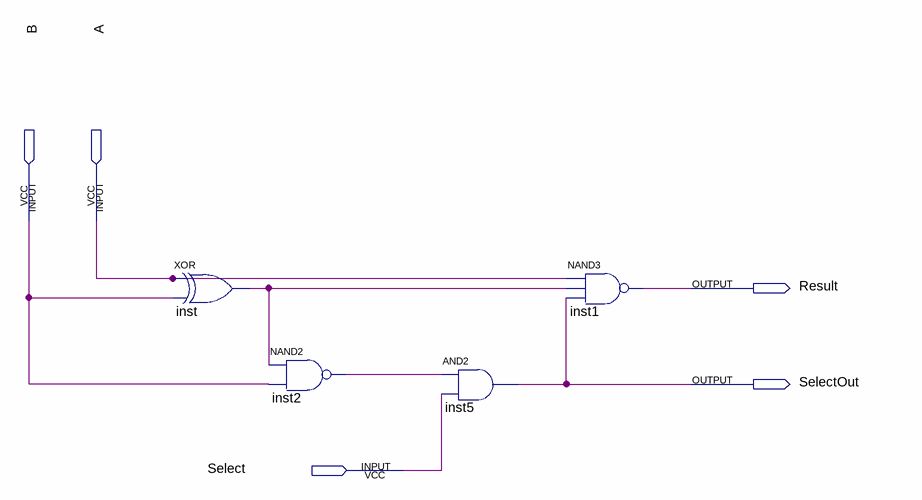
[diagram p0: schematic sheet]
// Quartus schematic Bit_maior_que_bit.bdf as structural Verilog: 4 symbols, 5 pins
module Bit_maior_que_bit (
  input  B,
  input  A,
  input  Select,
  output Result,
  output SelectOut
);

  wire inst2_out, inst_out;

  xor inst (inst_out, A, B);
  nand inst2 (inst2_out, inst_out, B);
  and inst5 (SelectOut, inst2_out, Select);
  nand inst1 (Result, A, inst_out, SelectOut);
endmodule
